# EAGLE board AK4493-v1.64_25 (EAGLE 9.6.2)
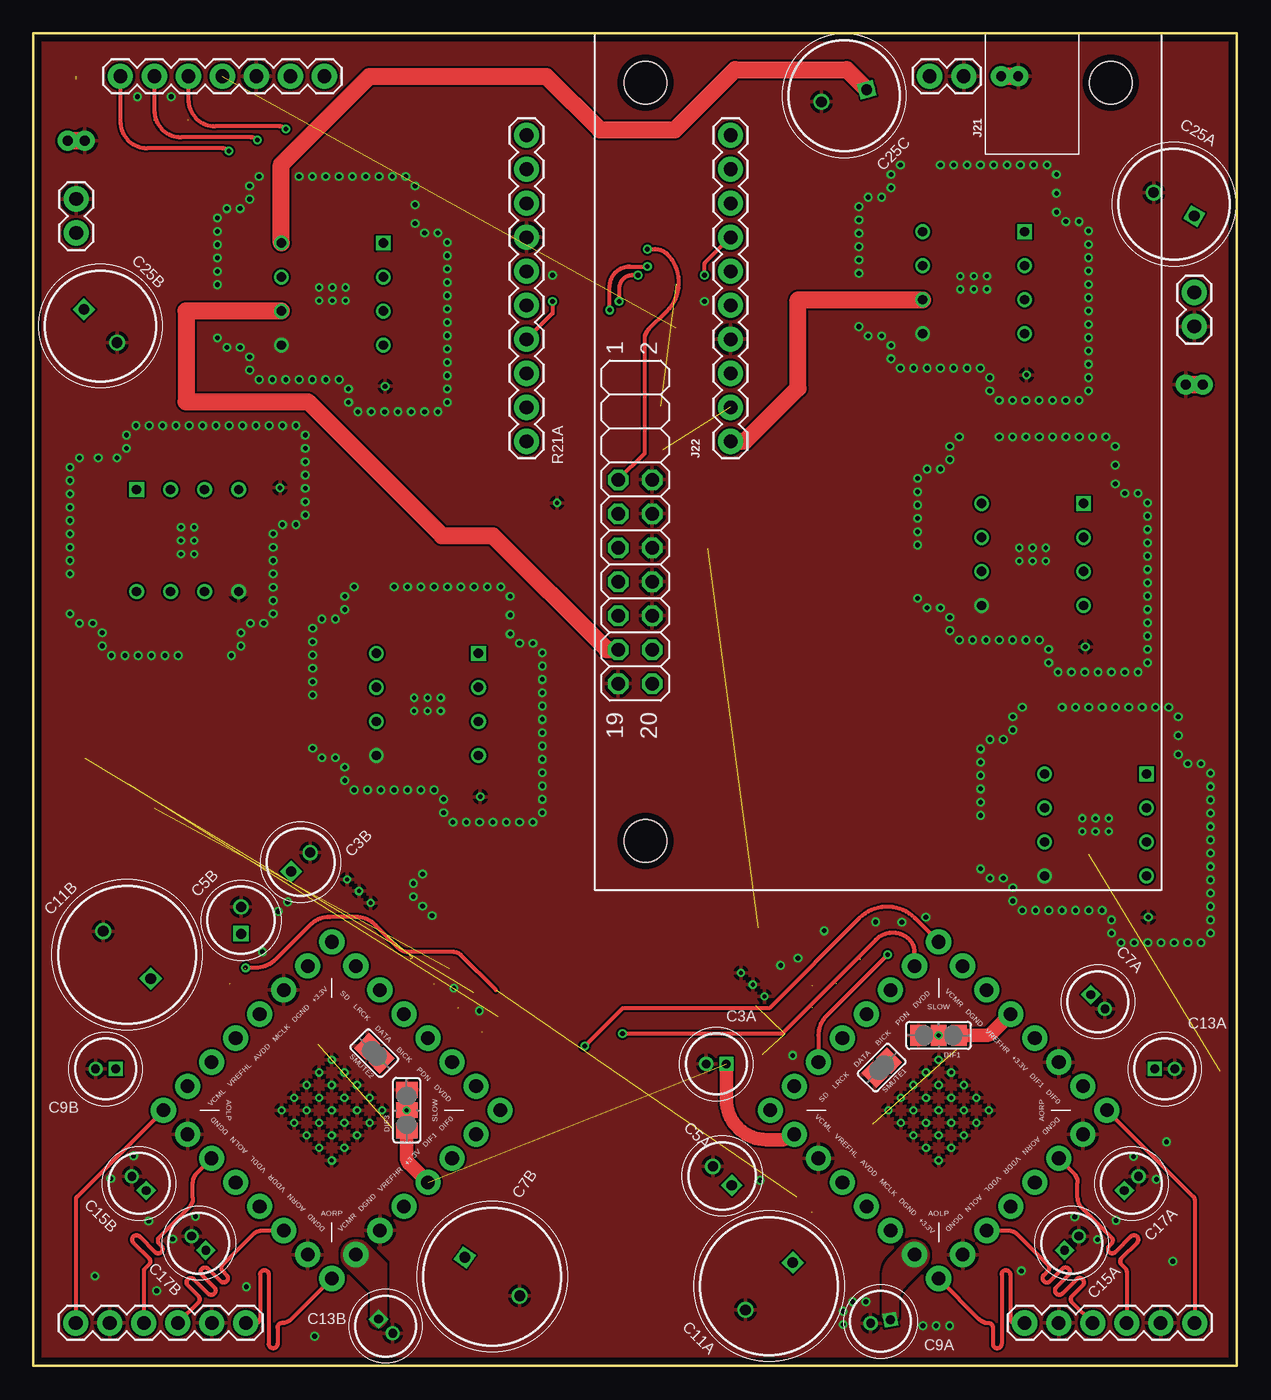
[diagram p2: board, top side]
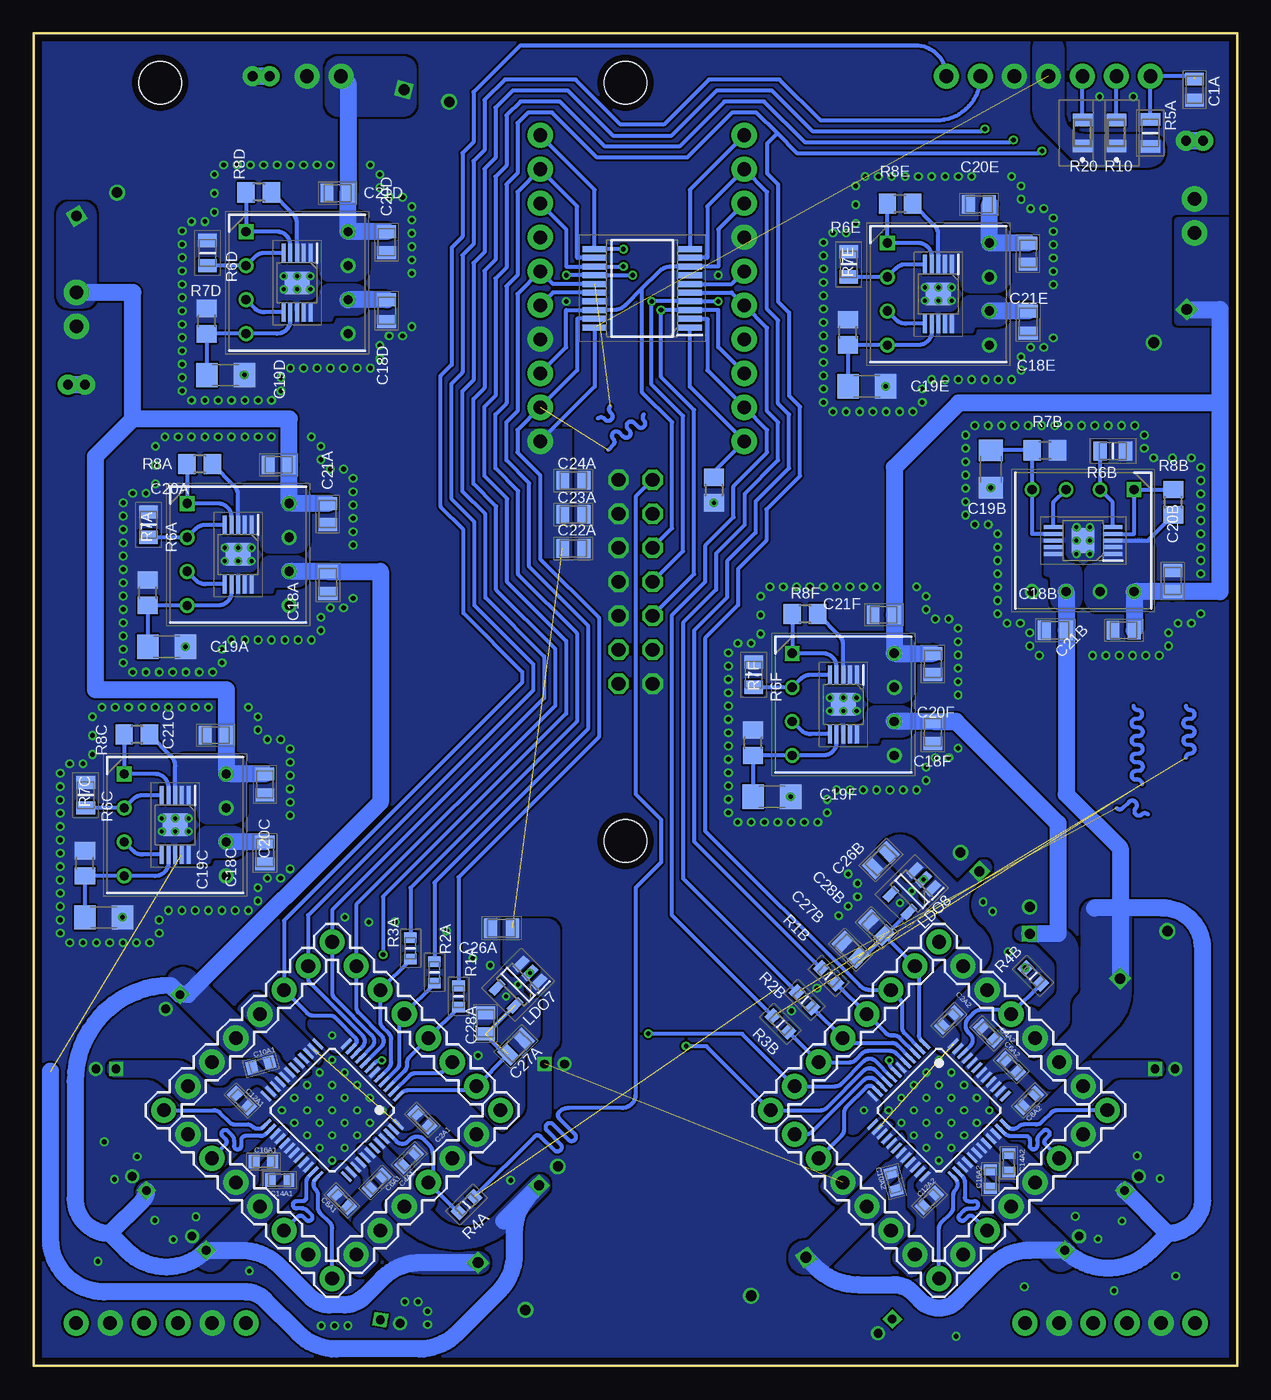
[diagram p3: board, bottom side, seen from below]

Size 89.89 x 99.5 mm. Coordinates in mm from the lower left corner, seen from the top.
Outline: 0,99.5 89.89,99.5 89.89,0 0,0 0,99.5
Copper layers (1*16): Top 0.035mm / dielectric 1.6mm / Bottom 0.035mm
Design rules "Elecrow_2-layer_PCB_eagle_rule": minimum track width 6mil, minimum drill 12mil, track to track 6mil, track to pad 6mil, pad to pad 6mil, via to via 8mil, smd to smd 0mil, copper to edge 20mil, drill to drill 10mil, minimum pad ring 6mil, minimum via ring 6mil, stop-mask expansion 0mil, vias tented up to drill 100mil, thermal gap 10mil
Net classes: 3 Power: width 1.27 mm, drill 1.27 mm, clearance 0.254 mm

## Footprints (pad centres in the part's own frame; a part is rotated, then mirrored left to right if it is on the bottom)
I2SOVERUSBV3 = drill 1.016 octagon: H3.7 33.322,1.745; H3.8 33.322,4.285; H3.9 35.862,1.745; H3.10 35.862,4.285; H3.11 38.403,1.745; H3.12 38.403,4.285; H3.13 40.943,1.745; H3.14 40.943,4.285; H3.15 43.483,1.745; H3.16 43.483,4.285; H3.17 46.023,1.745; H3.18 46.023,4.285; H3.19 48.562,1.745; H3.20 48.562,4.285 | hole 3.175: 3.688,3.775; 3.688,38.525; 60.312,3.775
CAPC2012X135N = smd 0.96 x 1.39: 1 -0.79,0; 2 0.79,0
CAPC1608X95N = smd 0.81 x 0.99: 1 -0.69,0; 2 0.69,0
CAPPRD150W45D450H600 = drill 0.65 pad 1.05 square: 1 0,0 | drill 0.65 pad 1.05: 2 1.5,0
CAPPRD200W55D500H800 = drill 0.75 pad 1.15 square: 1 0,0 | drill 0.75 pad 1.15: 2 2,0
CAPPRD500W60D1025H2150 = drill 0.8 pad 1.2 square: 1 0,0 | drill 0.8 pad 1.2: 2 5,0
CAPC2013X140N = smd 0.96 x 1.44: 1 -0.82,0; 2 0.82,0
C1206 = smd 1.6 x 1.8: 1 -1.4,0; 2 1.4,0 | drill 0.35: DGND 1.4,0
CAPPRD350W60D825H1300 = drill 0.8 pad 1.2 square: 1 0,0 | drill 0.8 pad 1.2: 2 3.5,0
SJ_2 = smd 1.168 x 1.6: 1 -1.524,0; 2 0,0; 3 1.524,0
SOP50P490X110-11N = smd 1.425 x 0.3: 1 -2.212,1; 2 -2.212,0.5; 3 -2.212,0; 4 -2.212,-0.5; 5 -2.212,-1; 6 2.212,-1; 7 2.212,-0.5; 8 2.212,0; 9 2.212,0.5; 10 2.212,1 | smd 1.68 x 1.88: 11 0,0 | drill 0.305 pad 0.61: P$1 -0.498,0; P$2 0.498,0; P$3 -0.498,0.995; P$4 0.498,0.995; P$5 -0.498,-0.995; P$6 0.498,-0.995
LQFP48_ = smd 0.25 x 1: 1 -2.75,-4.25; 2 -2.25,-4.25; 3 -1.75,-4.25; 4 -1.25,-4.25; 5 -0.75,-4.25; 6 -0.25,-4.25; 7 0.25,-4.25; 8 0.75,-4.25; 9 1.25,-4.25; 10 1.75,-4.25; 11 2.25,-4.25; 12 2.75,-4.25; 25 2.75,4.25; 26 2.25,4.25; 27 1.75,4.25; 28 1.25,4.25; 29 0.75,4.25; 30 0.25,4.25; 31 -0.25,4.25; 32 -0.75,4.25; 33 -1.25,4.25; 34 -1.75,4.25; 35 -2.25,4.25; 36 -2.75,4.25 | smd 1 x 0.25: 13 4.25,-2.75; 14 4.25,-2.25; 15 4.25,-1.75; 16 4.25,-1.25; 17 4.25,-0.75; 18 4.25,-0.25; 19 4.25,0.25; 20 4.25,0.75; 21 4.25,1.25; 22 4.25,1.75; 23 4.25,2.25; 24 4.25,2.75; 37 -4.25,2.75; 38 -4.25,2.25; 39 -4.25,1.75; 40 -4.25,1.25; 41 -4.25,0.75; 42 -4.25,0.25; 43 -4.25,-0.25; 44 -4.25,-0.75; 45 -4.25,-1.25; 46 -4.25,-1.75; 47 -4.25,-2.25; 48 -4.25,-2.75 | drill 0.305 pad 0.61: P$1 0,0; P$2 -1.327,0; P$3 -2.655,0; P$4 1.327,0; P$5 2.655,0; P$6 0,1.327; P$7 0,2.655; P$8 0,-1.327; P$9 0,-2.655; P$10 -1.327,-1.327; P$11 -2.655,-1.327; P$12 -2.655,-2.655; P$13 -1.327,-2.655; P$14 1.327,-2.655; P$15 2.655,-2.655; P$16 2.655,-1.327; P$17 1.327,-1.327; P$18 1.327,1.327; P$19 2.655,1.327; P$20 2.655,2.655; P$21 1.327,2.655; P$22 -1.327,2.655; P$23 -2.655,2.655; P$24 -2.655,1.327; P$25 -1.327,1.327
SOP65P780X200-20N = smd 1.8 x 0.45: 1 -3.55,2.925; 2 -3.55,2.275; 3 -3.55,1.625; 4 -3.55,0.975; 5 -3.55,0.325; 6 -3.55,-0.325; 7 -3.55,-0.975; 8 -3.55,-1.625; 9 -3.55,-2.275; 10 -3.55,-2.925; 11 3.55,-2.925; 12 3.55,-2.275; 13 3.55,-1.625; 14 3.55,-0.975; 15 3.55,-0.325; 16 3.55,0.325; 17 3.55,0.975; 18 3.55,1.625; 19 3.55,2.275; 20 3.55,2.925
1X02 = drill 1.016 pad 1.88: 1 0,0; 2 2.54,0
1X07 = drill 1.016 pad 1.88: 1 0,0; 2 2.54,0; 3 5.08,0; 4 7.62,0; 5 10.16,0; 6 12.7,0; 7 15.24,0
1X06 = drill 1.016 pad 1.88: 1 0,0; 2 2.54,0; 3 5.08,0; 4 7.62,0; 5 10.16,0; 6 12.7,0
DIPS762W51P254L1016H390Q8N = drill 0.7 pad 1.1 square: 1 0,0 | drill 0.7 pad 1.1: 2 0,-2.54; 3 0,-5.08; 4 0,-7.62; 5 7.62,-7.62; 6 7.62,-5.08; 7 7.62,-2.54; 8 7.62,0
1X10 = drill 1.016 pad 1.88: 1 0,0; 2 2.54,0; 3 5.08,0; 4 7.62,0; 5 10.16,0; 6 12.7,0; 7 15.24,0; 8 17.78,0; 9 20.32,0; 10 22.86,0
SOT95P280X145-5N = smd 1.2 x 0.6: 1 -1.25,0.95; 2 -1.25,0; 3 -1.25,-0.95; 4 1.25,-0.95; 5 1.25,0.95 | drill 0.305 pad 0.61: DGND -1.25,0; DGND2 0,0; DGND3 1.25,0
RESC1608X55N = smd 0.8 x 0.95: 1 -0.8,0; 2 0.8,0
RESC2012X50N = smd 0.95 x 1.45: 1 -1,0; 2 1,0
RESC2012X60N = smd 1 x 1.4: 1 -0.95,0; 2 0.95,0
R0805 = smd 1.3 x 1.5: 1 -0.95,0; 2 0.95,0
RCS0805_E3 = smd 0.95 x 1.45: 1 -0.975,0; 2 0.975,0
R0805-POL = smd 1.3 x 1.5: 1 -0.95,0; 2 0.95,0 | drill 0.305 pad 0.61: DGND 0.95,0
SHORT_ALL-50 = drill 0.737 pad 1.524: 1 -0.635,0; 2 0.635,0
SJ = smd 1.168 x 1.6: 1 -0.762,0; 2 0.762,0

## Placement (x,y rotation side)
BD1  I2SOVERUSBV3  [I2SOVERUSBV3]  41.93,99.5 270 top
C1A  0.1uF, X7R  [CAPC2012X135N]  3.19,95.31 270 bottom
C2A1  0.1u, Ceramic Capacitor X7R  [CAPC1608X95N]  60.87,18.35 315 bottom
C2A2  0.1u, Ceramic Capacitor X7R  [CAPC1608X95N]  21.55,25.82 45 bottom
C3A  80-A758BG106M1EAAE70  [CAPPRD150W45D450H600]  51.75,22.53 180 top
C3B  80-A758BG106M1EAAE70  [CAPPRD200W55D500H800]  19.25,36.9 45 top
C4A1  0.1u, Ceramic Capacitor X7R  [CAPC1608X95N]  61.86,15.42 45 bottom
C4A2  0.1u, Ceramic Capacitor X7R  [CAPC1608X95N]  18.62,24.83 135 bottom
C5A  80-A758BG106M1EAAE70  [CAPPRD200W55D500H800]  52.15,13.47 135 top
C5B  80-A758BG106M1EAAE70  [CAPPRD200W55D500H800]  15.5,32.26 90 top
C6A1  0.1u, Ceramic Capacitor X7R  [CAPC1608X95N]  64.3,13.68 225 bottom
C6A2  0.1u, Ceramic Capacitor X7R  [CAPC1608X95N]  16.88,22.39 315 bottom
C7A  RNU1A100MDSASQ  [CAPPRD150W45D450H600]  78.97,27.72 315 top
C7B  APSG160ELL222MJ20S  [CAPPRD500W60D1025H2150]  32.22,8.09 325 top
C8A1  0.1u, Ceramic Capacitor X7R  [CAPC1608X95N]  66.88,12.34 315 bottom
C8A2  0.1u, Ceramic Capacitor X7R  [CAPC1608X95N]  15.54,19.81 45 bottom
C9A  647-RNU1A100MDSASQ  [CAPPRD150W45D450H600]  64,3.44 190 top
C9B  647-RNU1A100MDSASQ  [CAPPRD150W45D450H600]  6.14,22.17 180 top
C10A1  0.1u, Ceramic Capacitor X7R  [CAPC1608X95N]  72.93,22.46 195 bottom
C10A2  0.1u, Ceramic Capacitor X7R  [CAPC1608X95N]  25.66,13.75 285 bottom
C11A  APSG160ELL222MJ20S  [CAPPRD500W60D1025H2150]  56.71,7.7 225 top
C11B  2200uF, 10V  [CAPPRD500W60D1025H2150]  8.75,28.92 135 top
C12A1  0.1u, Ceramic Capacitor X7R  [CAPC1608X95N]  74.34,19.8 315 bottom
C12A2  0.1u, Ceramic Capacitor X7R  [CAPC1608X95N]  23.01,12.34 45 bottom
C13A  647-RNU1A100MDSASQ  [CAPPRD150W45D450H600]  83.75,22.17 0 top
C13B  647-RNU1A100MDSASQ  [CAPPRD150W45D450H600]  25.77,3.49 315 top
C14A1  0.1u, Ceramic Capacitor X7R  [CAPC1608X95N]  71.53,13.86 180 bottom
C14A2  0.1u, Ceramic Capacitor X7R  [CAPC1608X95N]  17.06,15.15 270 bottom
C15A  647-RNU1A100MDSASQ  [CAPPRD150W45D450H600]  77.01,8.62 45 top
C15B  647-RNU1A100MDSASQ  [CAPPRD150W45D450H600]  8.41,13.08 135 top
C16A1  0.1u, Ceramic Capacitor X7R  [CAPC1608X95N]  72.74,15.24 0 bottom
C16A2  0.1u, Ceramic Capacitor X7R  [CAPC1608X95N]  18.45,13.95 90 bottom
C17A  647-RNU1A100MDSASQ  [CAPPRD150W45D450H600]  81.48,13.08 45 top
C17B  647-RNU1A100MDSASQ  [CAPPRD150W45D450H600]  12.88,8.62 135 top
C18A  4.7u  [CAPC2013X140N]  67.93,58.5 270 bottom
C18B  4.7u  [CAPC2013X140N]  13.6,54.93 180 bottom
C18C  4.7u  [CAPC2013X140N]  72.63,38.3 270 bottom
C18D  4.7u  [CAPC2013X140N]  63.53,78.8 270 bottom
C18E  4.7u  [CAPC2013X140N]  15.63,77.95 270 bottom
C18F  4.7u  [CAPC2013X140N]  22.73,47.3 270 bottom
C19A  22u  [C1206]  79.97,53.69 0 bottom
C19B  22u  [C1206]  18.41,66.97 270 bottom
C19C  22u  [C1206]  84.67,33.49 0 bottom
C19D  22u  [C1206]  75.57,73.99 0 bottom
C19E  22u  [C1206]  27.67,73.14 0 bottom
C19F  22u  [C1206]  34.77,42.49 0 bottom
C20A  10u  [CAPC2012X135N]  71.61,67.28 180 bottom
C20B  10u  [CAPC2012X135N]  4.82,58.61 90 bottom
C20C  10u  [CAPC2012X135N]  72.63,43.41 270 bottom
C20D  10u  [CAPC2012X135N]  63.53,83.91 270 bottom
C20E  10u  [CAPC2012X135N]  19.31,86.73 180 bottom
C20F  10u  [CAPC2012X135N]  22.73,52.41 270 bottom
C21A  0.1u  [CAPC2012X135N]  67.93,63.61 270 bottom
C21B  0.1u  [CAPC2012X135N]  8.49,54.93 180 bottom
C21C  0.1u  [CAPC2012X135N]  76.31,47.08 180 bottom
C21D  0.1u  [CAPC2012X135N]  67.21,87.58 180 bottom
C21E  0.1u  [CAPC2012X135N]  15.63,83.06 270 bottom
C21F  0.1u  [CAPC2012X135N]  26.41,56.08 180 bottom
C22A  0.1u, Ceramic Capacitor X7R  [CAPC2012X135N]  49.59,61.03 0 bottom
C23A  0.1u, Ceramic Capacitor X7R  [CAPC2012X135N]  49.59,63.57 0 bottom
C24A  0.1u, Ceramic Capacitor X7R  [CAPC2012X135N]  49.59,66.11 0 bottom
C25A  470u  [CAPPRD350W60D825H1300]  86.7,85.87 150 top
C25B  470u  [CAPPRD350W60D825H1300]  3.77,78.89 315 top
C25C  470u  [CAPPRD350W60D825H1300]  62.24,95.3 195 top
C26A  4.7u, Ceramic Capacitor X7R  [CAPC2013X140N]  54.96,32.68 180 bottom
C26B  4.7u, Ceramic Capacitor X7R  [CAPC2013X140N]  26.62,37.76 225 bottom
C27A  4.7u, Ceramic Capacitor X7R  [CAPC2013X140N]  53.87,23.84 45 bottom
C27B  4.7u, Ceramic Capacitor X7R  [CAPC2013X140N]  28.89,31.07 135 bottom
C28A  0.1u, Ceramic Capacitor X7R  [CAPC2012X135N]  56.14,25.57 90 bottom
C28B  0.1u, Ceramic Capacitor X7R  [CAPC2012X135N]  26.93,32.71 135 bottom
DIF1  [SJ_2]  67.61,24.67 0 top
DIF3  [SJ_2]  27.88,19.08 270 top
IC1  LT3042  [SOP50P490X110-11N]  74.63,60.59 270 bottom
IC2  AK4493  [LQFP48_]  67.61,19.08 135 bottom
IC3  AK4493  [LQFP48_]  22.28,19.08 225 bottom
IC4  LT3042  [SOP50P490X110-11N]  79.33,40.39 270 bottom
IC4A  SN74ABT273DBR  [SOP65P780X200-20N]  44.44,80.47 180 bottom
IC5  LT3042  [SOP50P490X110-11N]  11.51,61.63 180 bottom
IC6  LT3042  [SOP50P490X110-11N]  70.23,80.89 270 bottom
IC7  LT3042  [SOP50P490X110-11N]  29.43,49.39 270 bottom
IC8  LT3042  [SOP50P490X110-11N]  22.33,80.04 270 bottom
J1  [1X02]  3.19,84.6 90 top
J2  [1X02]  66.94,96.31 0 top
J3  [1X07]  6.49,96.31 0 top
J4  [1X06]  74.03,3.19 0 top
J5  [1X07]  80.18,19.08 45 bottom
J6  [1X07]  67.61,6.51 135 bottom
J7  [1X07]  55.03,19.08 225 bottom
J8  [1X07]  67.61,31.65 315 bottom
J9  [1X07]  22.28,6.51 135 bottom
J10  [1X07]  9.71,19.08 225 bottom
J11  [1X07]  22.28,31.65 315 bottom
J12  [1X07]  34.85,19.08 45 bottom
J13  [1X06]  3.16,3.19 0 top
J14  [1X02]  86.7,80.16 270 top
J15  XR2A-0811-N  [DIPS762W51P254L1016H390Q8N]  78.44,64.4 0 bottom
J16  XR2A-0811-N  [DIPS762W51P254L1016H390Q8N]  83.14,44.2 0 bottom
J17  XR2A-0811-N  [DIPS762W51P254L1016H390Q8N]  7.7,65.44 270 bottom
J18  XR2A-0811-N  [DIPS762W51P254L1016H390Q8N]  74.04,84.7 0 bottom
J19  XR2A-0811-N  [DIPS762W51P254L1016H390Q8N]  33.24,53.2 0 bottom
J20  XR2A-0811-N  [DIPS762W51P254L1016H390Q8N]  26.14,83.85 0 bottom
J21  [1X10]  36.82,91.9 270 top
J22  [1X10]  52.06,69.04 90 top
LDO7  LP5907-1.8V  [SOT95P280X145-5N]  53.72,28.46 225 bottom
LDO8  LP5907-1.8V  [SOT95P280X145-5N]  24.31,35.44 225 bottom
R1A  RT0603DRE075R1L  [RESC1608X55N]  58.17,27.57 270 bottom
R1B  RT0603DRE075R1L  [RESC1608X55N]  30.53,29.12 315 bottom
R2A  RT0603DRE075R1L  [RESC1608X55N]  59.96,29.37 270 bottom
R2B  RT0603DRE075R1L  [RESC1608X55N]  32.32,27.32 315 bottom
R3A  RT0603DRE075R1L  [RESC1608X55N]  61.76,31.16 270 bottom
R3B  RT0603DRE075R1L  [RESC1608X55N]  34.12,25.53 315 bottom
R4A  RT0603DRE075R1L  [RESC1608X55N]  57.57,12.04 225 bottom
R4B  RT0603DRE075R1L  [RESC1608X55N]  15.24,29.12 315 bottom
R5A  10K, Resistor 1%  [RESC2012X50N]  6.49,92.07 270 bottom
R6A  1k  [RESC2012X60N]  81.32,62.81 90 bottom
R6B  1k  [RESC2012X60N]  9.29,68.32 0 bottom
R6C  1k  [RESC2012X60N]  86.02,42.61 90 bottom
R6D  1k  [RESC2012X60N]  76.92,83.11 90 bottom
R6E  1k  [RESC2012X60N]  29.02,82.26 90 bottom
R6F  1k  [RESC2012X60N]  36.12,51.61 90 bottom
R7A  33k  [R0805]  81.37,57.73 90 bottom
R7B  33k  [R0805]  14.37,68.37 0 bottom
R7C  33k  [R0805]  86.07,37.53 90 bottom
R7D  33k  [R0805]  76.97,78.03 90 bottom
R7E  33k  [R0805]  29.07,77.18 90 bottom
R7F  33k  [R0805]  36.17,46.53 90 bottom
R8A  200k  [R0805]  77.49,67.33 180 bottom
R8B  200k  [R0805]  4.77,64.49 90 bottom
R8C  200k  [R0805]  82.19,47.13 180 bottom
R8D  200k  [R0805]  73.09,87.63 180 bottom
R8E  200k  [R0805]  25.19,86.78 180 bottom
R8F  200k  [R0805]  32.29,56.13 180 bottom
R10  2.2k, 1%  [RCS0805_E3]  9.03,92.07 90 bottom
R20  2.2k, 1%  [RCS0805_E3]  11.57,92.07 90 bottom
R21A  Not Pop.  [R0805-POL]  39.1,65.39 270 bottom
SH1  SHORTA5  [SHORT_ALL-50]  3.19,91.49 180 top
SH2  SHORTA5  [SHORT_ALL-50]  72.91,96.31 180 top
SH3  SHORTA5  [SHORT_ALL-50]  86.7,73.27 0 top
SMUTE1  [SJ]  63.35,22.26 225 top
SMUTE2  [SJ]  25.46,23.33 135 top

## Tracks (layer width: path | path; a pad name or v marks a point on that pad's centre or on a via)
+3V3  (5 unrouted)
  Top 1.016: 71.58,24.85 arc-45 71.15,24.67 DIF1.3 | 28.05,15.1 arc-45 27.88,15.53 DIF3.3 | J7.2 arc-45 55.86,16.88 54.75,16.88 arc-90 51.75,19.88 C3A.1
  Top 1.06: J5.5 71.58,24.85 | J9.5 28.05,15.1
  Top 1.272: J22.1 53.14,69.04 57.1,73 57.1,79.62 J18.6
  Bottom 0.305: IC4A.20 47.99,73.11 J22.1
  Bottom 1.272: C18D.1 J18.6
  pour Bottom (no thermals): 5.39,90.74 arc90 6.64,89.49 10.87,89.49 arc45 12.28,90.08 14.72,92.52 arc45 15.3,93.93 15.3,98.36 arc90 14.17,99.5 arc90 12.92,98.25 12.92,93.49 arc-90 11.42,91.99 6.64,91.99 arc90
  pour Bottom (no thermals): 21.82,26.84 18.97,29.68 arc-90 18.97,30.54 19.8,31.37 arc-90 20.66,31.37 23.6,28.43 arc-45 23.82,27.88 23.82,25.22 arc-45 23.64,24.79 22.36,23.51 arc-90 21.5,23.51 20.99,24.01 arc-90 20.99,25.15 21.82,25.97 arc90
  pour Bottom (no thermals): 56.14,15.77 55.32,16.59 arc-90 55.32,17.46 58.25,20.39 arc-45 58.8,20.62 61.46,20.62 arc-45 61.89,20.44 63.18,19.16 arc-90 63.18,18.29 62.67,17.78 arc-90 61.54,17.78 60.71,18.61 arc90 59.85,18.61 57,15.77 arc-90
  pour Bottom (rank 2, no thermals): 29.29,12.18 24.99,16.48 arc-90 24.99,17.34 25.79,18.14 arc-90 26.65,18.14 30.95,13.84 arc-90 30.95,12.97 30.15,12.18 arc-90
  pour Bottom (rank 2, no thermals): 74.51,26.09 70.21,21.79 arc-90 69.35,21.79 68.55,22.58 arc-90 68.55,23.45 72.85,27.75 arc-90 73.71,27.75 74.51,26.95 arc-90
  pour Bottom (no thermals): 23.59,34.92 23.48,34.82 arc-90 23.02,34.82 21.58,36.27 arc-90 21.58,36.73 24.05,39.2 arc-90 26.31,39.2 26.74,38.77 arc-90 26.74,38.31 24.71,36.28 arc-90 24.25,36.28 23.48,37.05 arc90 23.02,37.05 22.7,36.73 arc90 22.7,36.27 23.59,35.38 arc-90
  pour Bottom (no thermals): 20.91,36.06 19.28,37.69 arc45 18.96,37.83 arc90 18.33,37.2 arc45 18.47,36.88 19.48,35.87 arc-90 19.48,33.04 18.97,32.53 arc90 18.97,29.68 20.66,31.37 arc-90 20.66,32 23.48,34.82 21.58,36.73
  pour Bottom (no thermals): 54.89,30.16 54.89,33.15 arc90 54.64,33.4 51.57,33.4 arc90 50.57,32.4 50.57,24.44 arc45 50.86,23.73 50.92,23.68 arc-45 51.22,22.97 51.22,21.66 arc90 52.21,20.66 arc90 53.02,21.46 53.02,22.88 arc45 52.72,23.58 52.14,24.16 arc-45 51.85,24.87 51.85,27.36 arc-90 52.1,27.61 52.57,27.61 arc45 52.75,27.69 53.06,27.99 arc90 53.06,28.35 52.06,29.34 arc-90 52.06,29.7 52.49,30.12 arc-90 52.84,30.12 53.72,29.24 arc90 54.07,29.24 54.81,29.98 arc45
  pour Bottom (no thermals): 51.22,21.66 51.22,19.05 arc47 51.84,17.6 54.03,15.54 arc88 56.81,15.58 57,15.77 55.32,17.46 arc-90 54.45,17.46 53.31,18.6 arc-45 53.02,19.31 53.02,21.66
  pour Bottom (no thermals): 69.9,79.39 69.9,77.96 67.79,77.96 arc-90 67.56,78.19 arc90 67.33,78.42 65.9,78.42 arc-90 64.9,79.42 64.9,79.81 arc-90 65.9,80.81 67.84,80.81 arc-90 68.56,80.1 arc90 69.27,79.39
  pour Bottom (no thermals): 52.06,60.33 52.06,66.6 53.76,68.26 53.76,69.97 49.67,69.97 49.67,60.58 arc90 49.92,60.33
+5V/1
  Bottom 1.272: 84.22,9.88 arc90 86.8,12.46 86.8,21.26 arc90 79.66,28.4 C7A.1 78.38,27.72 64,42.1 64,59.32 C18A.1 J15.6 | 81.48,13.04 arc45 81.77,12.33 84.22,9.88 | 84.22,9.88 82.96,8.62 arc-90 C15A.1 | C15A.1 | C15A.1 74.38,8.62 arc45 71.55,7.45 69.24,5.14 arc-45 67.82,4.55 66.65,4.55 arc-45 65.23,5.14 63.84,6.53 arc45 61.01,7.7 C11A.1
  pour Bottom (no thermals): 63.77,11.54 62.5,10.27 arc90 62.5,9.41 63.33,8.58 arc90 64.19,8.58 65.87,10.26 arc90 65.87,11.12 64.18,12.81 arc-90 64.18,13.67 64.54,14.03 arc45 64.72,14.46 64.72,14.63 arc-45 64.9,15.06 65.6,15.77 arc180 65.01,16.37 62.84,14.2 arc90 62.84,13.34 63.77,12.4 arc-90
  pour Bottom (no thermals): 70.32,21.68 71.41,22.77 arc45 71.48,22.95 arc-45 71.54,23.09 74.52,26.07 arc-90 75.39,26.07 76.3,25.15 arc-90 76.3,24.29 75.22,23.21 arc-45 74.79,23.03 73.65,23.03 arc45 73.22,22.85 72.53,22.16 arc-45 72.1,21.98 72.07,21.98 arc45 71.64,21.81 70.91,21.08 arc-180
  pour Bottom (no thermals): 68.9,15.06 arc-180 69.5,15.66 71.75,13.41 arc45 72.18,13.23 73.09,13.23 arc-45 73.52,13.05 74.51,12.07 arc-90 74.51,11.21 73.68,10.38 arc-90 72.82,10.38 70.3,12.9 arc-45 70.12,13.33 70.12,13.59 arc45 69.95,14.02
  pour Bottom (no thermals): 71.62,17.78 arc180 71.02,17.18 72.91,15.29 arc-45 73.09,14.86 73.09,13.95 arc45 73.27,13.52 73.79,13 arc90 76.3,13 arc90 76.3,13.86 74.56,15.61 arc45 74.13,15.79 73.87,15.79 arc-45 73.44,15.97
  pour Bottom (no thermals): 76.3,24.29 79.64,27.62 arc90 79.64,29.41 arc90 77.86,29.41 74.52,26.07
  pour Bottom (rank 2, no thermals): 62.5,10.27 arc-45 58,8.54 56.66,8.54 arc90 55.81,7.69 arc90 56.66,6.84 60.93,6.84 arc45 63.52,7.91 64.19,8.58
  pour Bottom (no thermals): 72.82,10.38 75.84,7.36 arc90 77.53,7.36 77.74,7.57 arc90 77.74,8.84 74.51,12.07
  pour Bottom (no thermals): 74.12,14.36 arc90 74.12,12.66 74.47,12.32 arc45 75.18,12.03 81.36,12.03 arc90 82.27,12.93 arc90 81.36,13.83 76.76,13.83 arc-45 76.05,14.12 75.81,14.35 arc90
  pour Bottom (no thermals): 74.3,59.09 74.3,57.66 72.19,57.66 arc-90 71.96,57.89 arc90 71.73,58.12 70.3,58.12 arc-90 69.3,59.12 69.3,59.51 arc-90 70.3,60.51 72.24,60.51 arc-90 72.96,59.8 arc90 73.67,59.09
+5V/2
  Bottom 1.272: 5.17,9.88 arc-90 2.59,12.46 2.59,31.19 arc-90 5.59,34.19 10.68,34.19 | C7B.1 31.47,7.34 arc-45 28.35,6.05 25.67,6.05 arc45 24.25,5.46 23.67,4.89 arc-45 22.26,4.3 arc-45 20.94,4.85 18.34,7.45 arc45 15.51,8.62 C17B.1 arc-90 6.43,8.62 5.17,9.88 | C15B.1 5.21,9.88 5.17,9.88 | J17.6 C18B.1 12.78,42.68 8.75,38.65 C11B.1
  pour Bottom (no thermals): 24.88,16.37 25.98,15.28 arc45 26.15,15.2 arc-45 26.29,15.14 29.28,12.16 arc-90 29.28,11.3 28.36,10.38 arc-90 27.5,10.38 26.41,11.46 arc-45 26.24,11.89 26.24,13.04 arc45 26.06,13.47 25.37,14.16 arc-45 25.19,14.59 25.19,14.61 arc45 25.01,15.04 24.28,15.77 arc-180
  pour Bottom (no thermals): 14.75,22.91 13.48,24.18 arc90 12.61,24.18 11.79,23.36 arc90 11.79,22.5 13.47,20.82 arc90 14.33,20.82 16.01,22.5 arc-90 16.88,22.5 17.23,22.14 arc45 17.67,21.97 17.84,21.97 arc-45 18.27,21.79 18.97,21.08 arc180 19.57,21.68 17.4,23.85 arc90 16.54,23.85 15.61,22.91 arc-90
  pour Bottom (no thermals): 20.99,15.06 arc180 20.39,15.66 18.5,13.77 arc-45 18.06,13.59 17.16,13.59 arc45 16.72,13.41 15.38,12.07 arc90 15.38,11.21 16.21,10.38 arc90 17.07,10.38 18.82,12.13 arc45 18.99,12.56 18.99,12.82 arc-45 19.17,13.25
  pour Bottom (no thermals): 18.27,17.78 arc-180 18.87,17.18 16.61,14.93 arc45 16.43,14.5 16.43,13.59 arc-45 16.26,13.16 15.27,12.18 arc-90 14.41,12.18 13.58,13 arc-90 13.58,13.86 16.1,16.38 arc-45 16.53,16.56 16.79,16.56 arc45 17.22,16.74
  pour Bottom (no thermals): 11.68,28.29 11.68,33.83 arc90 10.68,34.83 8.88,34.83 arc90 7.88,33.83 7.88,28.06 arc45 9.06,25.23 11.79,22.5 13.48,24.18 12.62,25.04 arc-45 12.33,25.74 12.33,26.71 arc45 11.96,27.61 arc-45
  pour Bottom (no thermals): 27.5,10.38 30.47,7.41 arc45 31.88,6.82 32.27,6.82 arc90 33.54,8.09 arc90 32.27,9.37 arc-45 31.92,9.51 29.27,12.16
  pour Bottom (no thermals): 15.76,14.36 arc-90 14.07,14.35 arc-90
  pour Bottom (no thermals): 15.76,14.36 arc-90 15.77,12.66 15.42,12.32 arc-45 14.71,12.03 8.52,12.03 arc-90 7.62,12.93 arc-90 8.52,13.83 13.13,13.83 arc45 13.84,14.12 14.07,14.35 arc-90
  pour Bottom (no thermals): 17.07,10.38 14.05,7.36 arc-90 12.36,7.36 12.15,7.57 arc-90 12.15,8.84 15.38,12.07
  pour Bottom (no thermals): 13.01,61.3 14.44,61.3 14.44,59.19 arc-90 14.21,58.96 arc90 13.98,58.73 13.98,57.3 arc-90 12.98,56.3 12.59,56.3 arc-90 11.59,57.3 11.59,59.24 arc-90 12.3,59.96 arc90 13.01,60.67
+5V/3
  Top 1.272: J20.6 11.4,78.77 11.4,72 20.5,72 30.5,62 34.3,62 42.82,53.48 BD1.H3.17
  Bottom 1.272: C18E.1 J20.6
  pour Bottom (no thermals): 22,78.54 22,77.11 19.89,77.11 arc-90 19.66,77.34 arc90 19.43,77.57 18,77.57 arc-90 17,78.57 17,78.96 arc-90 18,79.96 19.94,79.96 arc-90 20.66,79.25 arc90 21.37,78.54
+5V/4
  Bottom 1.272: J19.6 C18F.1 21.02,48.12 13.4,40.5 13.4,32.26 C5B.1
  pour Bottom (no thermals): 13.58,25.15 14.98,26.55 arc-90 16.4,26.55 18.56,24.4 arc-45 18.65,24.18 18.65,24.14 arc45 18.74,23.93 20.28,22.39 arc-180 20.03,22.14 19.58,22.6 arc45 18.87,22.89 arc-45 18.37,23.1 17.4,24.06 arc90 16.54,24.06 15.61,23.13 14.75,23.13 13.58,24.29 arc-90
  pour Bottom (rank 2, no thermals): 16.66,32.27 arc90 16.08,32.84 13.83,32.84 arc90 11.83,30.84 11.83,24.09 14.2,21.72 16.87,24.39 13.76,27.49 arc-45 13.47,28.2 13.47,29.78 arc-45 13.76,30.49 14.67,31.4 arc-45 15.37,31.69 16.08,31.69 arc90
  pour Bottom (no thermals): 29.1,47.89 29.1,46.46 26.99,46.46 arc-90 26.76,46.69 arc90 26.53,46.92 25.1,46.92 arc-90 24.1,47.92 24.1,48.31 arc-90 25.1,49.31 27.04,49.31 arc-90 27.76,48.6 arc90 28.47,47.89
+5V/5  (1 unrouted)
  Bottom 1.272: 88.64,21.98 88.64,9.52 arc-90 84.64,5.52 74.05,5.52 arc45 72.63,4.93 70.12,2.42 arc-45 67.29,1.25 61.11,1.25 arc-45 58.28,2.42 55.17,5.53 arc-45 54,8.36 54,9.96 arc45 52.83,12.79 C5A.1 54.8,10.82 | C18C.1 J16.6
  pour Bottom (no thermals): 61.53,10.38 60.13,11.78 arc-90 60.13,13.19 62.29,15.35 arc-45 62.5,15.44 62.54,15.44 arc45 62.76,15.53 64.3,17.08 arc-180 64.54,16.83 64.09,16.37 arc45 63.79,15.67 arc-45 63.59,15.17 62.62,14.2 arc90 62.62,13.34 63.55,12.4 arc-90 63.55,11.54 62.39,10.38 arc-90
  pour Bottom (no thermals): 51.55,12.93 54.1,10.38 arc90 62.39,10.38 60.7,12.07 59.78,11.17 arc-89 55.56,11.19 52.69,14.06 arc90 51.55,14.06 arc90
  pour Bottom (no thermals): 79,38.89 79,37.46 76.89,37.46 arc-90 76.66,37.69 arc90 76.43,37.92 75,37.92 arc-90 74,38.92 74,39.31 arc-90 75,40.31 76.94,40.31 arc-90 77.66,39.6 arc90 78.37,38.89
BCLK
  Bottom 0.305: 44.44,80.47 43.19,81.72 arc45 42.29,82.09 IC4A.8 38.77,82.09 38.77,84.88 J21.3 | 44.44,80.47 45.7,79.22 arc45 46.59,78.84 IC4A.18 50.12,78.84 50.12,76.06 J22.3 | 44.44,80.47 44.44,72.69 42.21,70.46 42.21,62.56 BD1.H3.11
DATA  (via drill 0.35)
  Top 0.305: v45.15,81.44 44.74,81.44 arc90 43.74,80.44 v43.74,79.5 | v38.77,79.5 38.77,78.6 J21.7 | v50.12,81.44 50.12,82.34 J22.7
  Bottom 0.305: v45.15,81.44 IC4A.14 v50.12,81.44 | v38.77,79.5 IC4A.4 v43.74,79.5 43.74,73.27 41.39,70.92 41.39,60.84 BD1.H3.13
DGND  (via drill 0.35)
  other vias: 73.15,35.7 72.44,36.41 82.23,31.6 81.23,31.6 80.53,32.3 80.53,33.3 76.84,34 77.83,34 78.83,34 79.82,34 29.07,36.72 28.36,36.02 28.36,35.02 29.07,34.32 29.77,33.61 87.91,32.3 87.2,31.6 86.21,31.6 85.21,31.6 84.22,31.6 83.22,31.6 68.42,2.98 67.42,2.98 66.43,2.98 60.48,3.07 60.48,4.07 61.18,4.77 62.18,4.77 77.77,11.12 79.47,9.42 5.78,13.97 7.48,15.67 10.4,9.46 12.1,11.16 82.17,15.62 83.87,13.92 18.98,34.63 18.27,33.93 17.1,30.9 33.3,26.5 31.4,28.2 54.27,13.85 57.1,30.44 59.06,32.48 62.9,33.15 64.86,33.13 66.66,33.5 10.28,94.77 7.76,94.77 85.1,7.8 84.63,16.72 73.78,7.08 80.85,10.86 21,2.2 15.9,5.9 9.2,5.6 4.6,6.7 8.6,10.8 55.8,29.9 56.71,23.17 50.12,79.5 38.77,81.44 71.14,54.2 70.15,54.2 69.15,54.2 68.45,54.91 68.45,55.9 67.74,56.61 77.53,51.8 76.53,51.8 75.83,52.5 75.83,53.5 72.14,54.2 73.13,54.2 74.13,54.2 75.12,54.2 83.21,52.5 82.5,51.8 81.51,51.8 80.51,51.8 79.52,51.8 78.52,51.8 66.04,64.28 66.04,57.31 66.75,56.61 66.04,61.29 66.04,62.29 66.04,63.28 67.74,66.97 68.45,67.68 66.04,65.27 66.04,66.27 66.75,66.97 69.15,69.38 68.45,68.67 80.8,65.86 81.51,65.15 72.14,69.38 73.13,69.38 77.11,69.38 76.12,69.38 75.12,69.38 74.13,69.38 78.11,69.38 79.11,69.38 80.1,69.38 80.8,68.67 80.8,67.26 83.21,63.45 83.21,64.45 82.5,65.15 83.21,62.46 83.21,61.46 83.21,60.47 83.21,59.47 83.21,58.48 83.21,57.48 83.21,56.49 83.21,55.49 83.21,54.5 83.21,53.5 66.74,74.5 65.75,74.5 64.75,74.5 64.05,75.21 64.05,76.2 63.34,76.91 73.13,72.1 72.13,72.1 71.43,72.8 71.43,73.8 67.74,74.5 68.73,74.5 69.73,74.5 70.72,74.5 78.81,72.8 78.1,72.1 77.11,72.1 76.11,72.1 75.12,72.1 74.12,72.1 78.81,77.78 78.81,76.79 78.81,75.79 78.81,74.8 78.81,73.8 78.81,82.76 78.81,81.76 78.81,80.77 78.81,79.77 78.81,78.78 78.81,83.75 78.81,84.75 78.1,85.45 76.4,86.16 77.11,85.45 67.74,89.68 68.73,89.68 72.71,89.68 71.72,89.68 70.72,89.68 69.73,89.68 73.71,89.68 74.71,89.68 75.7,89.68 76.4,88.97 76.4,87.56 64.75,89.68 64.05,88.97 63.34,87.27 64.05,87.98 61.64,85.57 61.64,86.57 62.35,87.27 61.64,84.58 61.64,77.61 62.35,76.91 61.64,81.59 61.64,82.59 61.64,83.58 6.24,67.8 6.95,68.51 2.72,59.14 2.72,60.13 2.72,64.11 2.72,63.12 2.72,62.12 2.72,61.13 2.72,65.11 2.72,66.11 2.72,67.1 3.43,67.8 4.84,67.8 8.65,70.21 7.65,70.21 6.95,69.5 9.64,70.21 10.64,70.21 11.63,70.21 12.63,70.21 13.62,70.21 14.62,70.21 15.61,70.21 16.61,70.21 17.6,70.21 16.2,55.45 15.49,54.74 20.3,64.53 20.3,63.53 19.6,62.83 18.6,62.83 17.9,59.14 17.9,60.13 17.9,61.13 17.9,62.12 19.6,70.21 20.3,69.5 20.3,68.51 20.3,67.51 20.3,66.52 20.3,65.52 18.6,70.21 17.9,58.14 17.9,57.15 17.9,56.15 17.19,55.45 7.82,53.04 14.79,53.04 15.49,53.75 10.81,53.04 9.81,53.04 8.82,53.04 6.83,53.04 5.83,53.04 5.13,53.75 5.13,54.74 4.42,55.45 2.72,56.15 3.43,55.45 22.54,55.77 23.25,56.48 23.95,58.18 23.25,57.47 35.6,54.66 36.31,53.95 26.94,58.18 27.93,58.18 31.91,58.18 30.92,58.18 29.92,58.18 28.93,58.18 32.91,58.18 33.91,58.18 34.9,58.18 35.6,57.47 35.6,56.06 38.01,51.26 38.01,50.26 38.01,49.27 38.01,48.27 38.01,47.28 38.01,52.25 38.01,53.25 37.3,53.95 38.01,46.28 38.01,45.29 38.01,44.29 38.01,43.3 23.25,44.7 22.54,45.41 32.33,40.6 31.33,40.6 30.63,41.3 30.63,42.3 26.94,43 27.93,43 28.93,43 29.92,43 38.01,41.3 37.3,40.6 36.31,40.6 35.31,40.6 34.32,40.6 33.32,40.6 38.01,42.3 25.94,43 24.95,43 23.95,43 23.25,43.71 20.84,53.08 20.84,46.11 21.55,45.41 20.84,50.09 20.84,51.09 20.84,52.08 20.84,54.07 20.84,55.07 21.55,55.77 25.81,88.83 26.81,88.83 27.8,88.83 28.5,88.12 28.5,86.71 28.5,85.31 29.21,84.6 19.84,88.83 20.83,88.83 24.81,88.83 23.82,88.83 22.82,88.83 21.83,88.83 30.91,82.9 30.91,83.9 30.2,84.6 30.91,81.91 30.91,80.91 30.91,79.92 30.91,78.92 30.91,77.93 30.91,76.93 30.91,75.94 30.91,74.94 30.91,73.95 16.15,75.35 15.44,76.06 25.23,71.25 24.23,71.25 23.53,71.95 23.53,72.95 19.84,73.65 20.83,73.65 21.83,73.65 22.82,73.65 30.91,71.95 30.2,71.25 29.21,71.25 28.21,71.25 27.22,71.25 26.22,71.25 30.91,72.95 18.84,73.65 17.85,73.65 16.85,73.65 16.15,74.36 13.74,83.73 13.74,76.76 14.45,76.06 13.74,80.74 13.74,81.74 13.74,82.73 13.74,84.72 13.74,85.72 14.45,86.42 15.44,86.42 16.15,87.13 16.85,88.83 16.15,88.12 72.44,46.77 73.15,47.48 73.85,49.18 73.15,48.47 85.5,45.66 86.21,44.95 76.84,49.18 77.83,49.18 81.81,49.18 80.82,49.18 79.82,49.18 78.83,49.18 82.81,49.18 83.81,49.18 84.8,49.18 85.5,48.47 85.5,47.06 87.91,43.25 87.91,44.25 87.2,44.95 87.91,42.26 87.91,41.26 87.91,40.27 87.91,39.27 87.91,38.28 87.91,37.28 87.91,36.29 87.91,35.29 87.91,34.3 87.91,33.3 75.84,34 74.85,34 73.85,34 73.15,34.71 70.74,44.08 70.74,37.11 71.45,36.41 70.74,41.09 70.74,42.09 70.74,43.08 70.74,45.07 70.74,46.07 71.45,46.77
  pour Top (rank 6): 0,0 0,99.5 89.89,99.5 89.89,0
  pour Bottom (rank 6, no thermals): 0,0 0,99.5 89.89,99.5 89.89,0
  pour Bottom (rank 6, no thermals): 53.26,18.65 67.18,4.73 arc90 68.04,4.73 81.95,18.65 arc90 81.95,19.51 68.04,33.42 arc90 67.18,33.42 53.26,19.51 arc90
  pour Top (rank 2): 52.11,19.08 67.61,3.59 83.1,19.08 67.61,34.57
  pour Bottom (no thermals): 68.62,22.1 69.96,23.45 70.21,23.2 68.86,21.86
  pour Bottom (rank 6, no thermals): 21.85,33.42 7.94,19.51 arc90 7.94,18.65 21.85,4.73 arc90 22.71,4.73 36.63,18.65 arc90 36.63,19.51 22.71,33.42 arc90
  pour Top (rank 2): 22.28,34.57 6.79,19.08 22.28,3.59 37.77,19.08
  pour Bottom (no thermals): 25.31,18.07 26.65,16.72 26.41,16.48 25.06,17.82
  pour Bottom (rank 6, no thermals): 84.66,45.72 84.66,35.06 74,35.06 74,45.72
  pour Top (no thermals): 84.66,45.72 74,45.72 74,35.06 84.66,35.06
  pour Bottom (rank 6, no thermals): 79.96,65.92 79.96,55.26 69.3,55.26 69.3,65.92
  pour Top (no thermals): 79.96,65.92 69.3,65.92 69.3,55.26 79.96,55.26
  pour Bottom (rank 6, no thermals): 6.18,66.96 16.84,66.96 16.84,56.3 6.18,56.3
  pour Top (no thermals): 6.78,68.16 6.78,57.5 17.44,57.5 17.44,68.16
  pour Bottom (rank 6, no thermals): 75.56,86.22 75.56,75.56 64.9,75.56 64.9,86.22
  pour Top (no thermals): 75.56,86.22 64.9,86.22 64.9,75.56 75.56,75.56
  pour Bottom (rank 6, no thermals): 34.76,54.72 34.76,44.06 24.1,44.06 24.1,54.72
  pour Top (no thermals): 34.76,54.72 24.1,54.72 24.1,44.06 34.76,44.06
  pour Bottom (rank 6, no thermals): 27.66,85.37 27.66,74.71 17,74.71 17,85.37
  pour Top (no thermals): 27.66,85.37 17,85.37 17,74.71 27.66,74.71
DIF0
  Bottom 0.305: IC2.10 65.35,23.81 arc-90 65.35,24.67 69.22,28.55 arc45 69.4,28.98 J5.7 69.4,33.64 52.6,50.45 52.6,52.4 56.98,56.78 56.98,63.02 58.68,64.72 58.68,73.36 57.86,74.18 57.86,82.94 57.04,83.76 57.04,89.98 56.22,90.8 56.22,94.54 54.7,96.06 | J3.6 arc90 22.51,92.99 31.11,92.99 34.19,96.06 39.46,96.06 42.82,92.7 46.06,92.7 49.42,96.06 54.7,96.06 | 54.7,96.06
DIF1
  Bottom 0.305: IC2.11 65.88,23.99 arc-90 65.88,24.5 67.36,25.98 arc-45 67.79,26.16 69.04,26.16 arc45 69.47,26.34 J5.6 71.2,33.24 53.42,51.03 53.42,51.82 57.8,56.2 57.8,62.44 59.5,64.14 59.5,73.94 58.68,74.76 58.68,83.52 57.86,84.34 57.86,90.56 57.04,91.38 57.04,95.12 53.56,98.6 24.02,98.6 arc90 J3.7
LRCK  (via drill 0.35)
  Top 0.305: v43.04,78.84 43.04,80.59 arc-90 44.54,82.09 v45.85,82.09
  Bottom 0.305: v45.85,82.09 IC4A.13 50.12,82.09 50.12,84.88 J22.8 | J21.8 38.77,76.06 38.77,78.84 IC4A.3 v43.04,78.84 43.04,73.85 40.57,71.39 40.57,59.12 BD1.H3.15
MCLK  (via drill 0.35)  (3 unrouted)
  Top 0.305: 34.55,28.05 31.9,30.7 arc45 31.44,30.89 28.04,30.89 arc-45 27.24,31.22 25.57,32.89 arc45 24.05,33.52 22.15,33.52 arc45 20.63,32.89 18.09,30.35 arc-45 16.57,29.72 v15.84,29.72 | v45.85,83.39 46.43,83.39 arc-45 47.33,83.02 arc-90 47.33,78.78 45.95,77.4 arc45 45.66,76.69 45.66,68.16 BD1.H3.7
  Bottom 0.305: 56.97,12.64 52.49,17.11 arc90 52.03,17.11 51.01,16.09 arc-90 50.55,16.09 arc-90 50.55,16.55 51.57,17.57 arc90 51.57,18.03 arc90 51.11,18.03 49.95,16.87 arc-90 49.49,16.87 arc-90 49.49,17.32 50.65,18.49 arc90 50.65,18.95 50.65,18.95 arc45 49.94,19.25 45.94,19.25 arc-90 44.94,20.25 44.94,35.69 43.03,37.6 43.03,40.79 44.94,42.7 44.94,64.91 BD1.H3.7 | v45.85,83.39 IC4A.11 47.99,87.83 J22.10
N$1
  Bottom 0.305: IC4A.1 40.89,73.11 J21.10 39.1,66.76 R21A.1
N$2
  pour Bottom (no thermals): 14.35,19.72 11.68,22.39 arc90 10.82,22.39 9.99,21.56 arc90 9.99,20.7 11.44,19.26 arc45 11.87,19.08 13.47,19.08 arc-45 13.9,18.9 14.6,18.2 arc45 15.03,18.02 16.62,18.02 arc45 17.05,18.2 18.21,19.35 arc90 18.21,20.22 17.39,21.03 arc90 16.53,21.03 15.21,19.72 arc-90
  pour Bottom (no thermals): 11.68,22.39 9.99,20.7 9.45,21.24 arc45 8.75,21.53 6.1,21.53 arc-90 5.47,22.17 arc-90 6.1,22.8 10.85,22.8 arc-45 11.56,22.51
N$3
  Bottom 0.305: J21.1 40.89,87.83 IC4A.10
N$4
  Bottom 0.305: IC4A.6 37.77,80.8 J21.5
N$5
  Bottom 0.305: IC4A.16 51.12,80.14 J22.5
N$14
  Bottom 0.305: C19A.1 R7A.1 J15.4 76.13,56.78 arc-90 75.13,57.78 IC1.7
N$17
  Bottom 0.305: IC5.4 7.7,62.13 J17.1 R8B.2
N$18
  Bottom 0.305: IC5.6 13.72,64.49 J17.3
N$19  (1 unrouted)
  Bottom 0.305: IC2.5 63.37,22.26 arc-45 63.19,22.69 63.19,24.38 arc-45 63.37,24.81 63.84,25.29 arc45 64.01,25.72 J8.3 61.76,30.31
N$20  (1 unrouted)
  Bottom 0.305: IC2.4 62.76,22.15 arc-45 62.59,22.58 62.59,25.64 arc45 62.41,26.07 J8.4 59.96,28.52
N$21  (1 unrouted)
  Bottom 0.305: IC2.3 62.19,22.02 arc-45 62.01,22.45 62.01,22.62 arc45 61.84,23.05 J8.5 58.17,26.72
N$22
  Bottom 0.305: R6B.1 J17.2 9.3,64.49 IC5.5
N$23  (2 unrouted)
  Bottom 0.305: 44.31,71.06 arc-90 44.31,70.6 arc90 44.31,70.14 arc90 44.77,70.14 45.06,70.43 arc-90 45.52,70.43 arc-90 45.52,69.97 45.41,69.85 arc90 45.41,69.39 arc90 45.87,69.39 46.15,69.68 arc-90 46.61,69.68 arc-90 46.61,69.22 arc90 46.61,68.76 46.98,68.39 | 46.98,68.39 | 58.17,28.42 58.17,36.48 47.68,46.97 47.68,55.88 52.06,60.26 52.06,66.5 53.76,68.2 53.76,69.88 J22.2 49.3,74.34 49.3,78.19 IC4A.19
N$24  (1 unrouted)
  Bottom 0.305: 47.75,70.74 arc90 47.29,70.74 47.21,70.66 arc-90 46.75,70.66 arc-90 46.75,71.12 46.83,71.2 arc90 46.83,71.66 | IC4A.15 51.12,80.8 J22.6 53.76,80.04 53.76,71.28 54.58,70.46 54.58,67.62 52.88,65.92 52.88,59.68 48.5,55.3 48.5,47.55 59.96,36.08 R2A.1
N$25
  Bottom 0.305: IC4A.12 49.3,82.75 49.3,86.6 J22.9 53.76,87.66 53.76,81.44 54.58,80.62 54.58,71.86 55.4,71.04 55.4,67.04 53.7,65.34 53.7,59.1 49.32,54.72 49.32,48.13 61.76,35.69 R3A.1
N$26
  Top 0.305: J6.6 77.69,14.38 arc-45 77.98,13.68 77.98,12.53 arc45 78.28,11.82 80.52,9.58 arc-90 80.52,9.12 80.34,8.94 arc90 80.34,8.48 arc90 80.8,8.48 81.97,9.65 arc-90 82.43,9.65 arc-90 82.43,9.19 81.26,8.02 arc90 81.26,7.56 81.56,7.26 arc-45 81.65,7.03 J4.4
  Bottom 0.305: IC2.26 72.54,17.33 arc45 72.97,17.15 74.11,17.15 arc-90 74.39,16.88 74.39,16.43 arc180 74.94,16.43 74.94,16.82 arc-45 75.12,17.25 75.4,17.53 arc-180 75.79,17.14 75.55,16.91 arc90 75.55,16.52 J6.6
N$27  (1 unrouted)
  Bottom 0.305: 29.93,28.52 J12.5 26.26,24.85 arc-45 25.83,24.67 25.65,24.67 arc45 25.22,24.49 IC3.3
N$28  (1 unrouted)
  Bottom 0.305: 31.72,26.72 J12.4 29.28,24.28 arc-45 28.85,24.1 25.79,24.1 arc45 25.36,23.92 IC3.4
N$29  (1 unrouted)
  Bottom 0.305: 33.52,24.93 J12.3 28.92,22.67 arc-45 28.49,22.85 28.02,23.32 arc45 27.59,23.5 25.89,23.5 arc45 25.46,23.32 IC3.5
N$30  (1 unrouted)
  Bottom 0.305: 9.02,41.65 arc-90 8.56,41.65 8.08,42.12 arc90 7.62,42.12 7.59,42.09 arc90 7.59,41.63 arc-90 7.59,41.17 arc-90 7.13,41.17 arc90 6.67,41.17 | IC4A.9 39.59,82.75 39.59,86.6 J21.2 35.12,87.66 35.12,78.9 34.3,78.08 34.3,71.86 33.48,71.04 33.48,67.04 35.99,64.54 35.99,62.21 38.11,60.09 38.11,57.38 40.57,54.92 40.57,39.16 R1B.1
N$31  (1 unrouted)
  Bottom 0.305: 3.7,46.37 arc90 4.03,46.7 arc90 3.7,47.02 3.52,47.02 arc-90 3.19,47.34 arc-90 3.52,47.67 3.7,47.67 | 3.52,45.72 arc-90 3.19,46.05 arc-90 3.52,46.37 3.7,46.37 | 3.7,46.37 | 3.52,45.72 | 3.84,45.4 arc90 3.52,45.72 | 3.7,47.67 arc90 4.03,47.99 arc90 3.7,48.32 3.52,48.32 arc-90 3.19,48.65 | 3.7,47.67 | 3.19,48.65 | 3.19,48.65 arc-90 3.52,48.97 arc90 3.84,49.3 | IC4A.5 37.77,80.14 J21.6 35.12,77.5 35.12,71.28 34.3,70.46 34.3,67.62 36.81,65.12 36.81,62.79 38.93,60.67 38.93,57.96 41.39,55.5 41.39,36.39 R2B.1
N$32  (1 unrouted)
  Bottom 0.305: 7.11,43.45 arc-90 7.43,43.77 7.57,43.77 arc90 7.9,44.1 | 7.43,48.97 arc90 7.11,48.65 arc90 7.43,48.32 7.57,48.32 arc-90 7.9,48 arc-90 7.57,47.67 7.39,47.67 arc90 7.06,47.35 arc90 7.39,47.02 7.57,47.02 arc-90 7.9,46.7 | 7.9,44.1 | 7.9,44.1 arc90 7.57,44.42 7.39,44.42 arc-90 7.06,44.75 arc-90 7.39,45.07 7.57,45.07 arc90 7.9,45.4 arc90 7.57,45.72 7.39,45.72 arc-90 7.06,46.05 arc-90 7.39,46.37 7.57,46.37 arc90 7.9,46.7 | 7.9,46.7 | 7.43,48.97 | 7.76,49.3 arc-90 7.43,48.97 | IC4A.2 39.59,78.19 39.59,74.34 J21.9 35.12,69.88 35.12,68.2 37.63,65.7 37.63,63.37 39.75,61.25 39.75,58.54 42.21,56.08 42.21,33.62 R3B.1
N$34
  Bottom 0.305: IC6.4 70.73,83.7 arc-90 71.73,84.7 J18.1 R8D.2
N$35  (1 unrouted)
  Bottom 0.305: 14.64,28.52 J11.4 16.95,26.32 arc-45 17.66,26.61 19.01,26.61 arc-45 19.72,26.32 20.09,25.95 arc-90 20.09,24.89 19.95,24.75 arc90 19.95,23.89 IC3.46
N$36
  Bottom 0.305: IC7.5 31.88,51.6 arc-45 32.59,51.31 J19.2 R6F.1
N$37  (2 unrouted)
  Bottom 0.305: 62.4,20.39 arc45 61.97,20.57 57.39,20.57 arc-45 56.96,20.75 J8.7 54.58,23.13 56.14,24.7 LDO7.5 | IC2.1 62.4,20.39 | 62.4,20.39
N$38
  Bottom 0.305: IC6.6 72.68,78.68 arc45 73.39,78.97 J18.3
N$40
  Bottom 0.305: IC6.5 72.68,83.1 arc-45 73.39,82.81 J18.2 R6D.1
N$41
  Bottom 0.305: IC1.6 77.08,58.38 arc45 77.79,58.67 J15.3
N$42
  Bottom 0.305: IC6.7 70.73,78.08 arc90 71.73,77.08 J18.4 R7D.1 C19D.1
N$43
  Bottom 0.305: R8F.2 J19.1 30.93,53.2 arc90 29.93,52.2 IC7.4
N$46
  Bottom 0.305: IC7.7 29.93,46.58 arc90 30.93,45.58 J19.4 R7F.1 C19F.1
N$47
  Bottom 0.305: IC8.4 22.83,82.85 arc-90 23.83,83.85 J20.1 R8E.2
N$51
  Bottom 0.305: IC8.6 24.78,77.83 arc45 25.49,78.12 J20.3
N$52
  Bottom 0.305: R6E.1 J20.2 25.49,81.96 arc45 24.78,82.25 IC8.5
N$53
  Bottom 0.305: C19E.1 R7E.1 J20.4 23.83,76.23 arc-90 22.83,77.23 IC8.7
N$66  (2 unrouted)
  Bottom 0.305: 26.32,32.09 28.11,30.3 28.18,30.37 | 26.32,32.09 26.3,32.07 J12.7 23.95,29.73 arc45 23.77,29.3 23.77,24.71 arc-45 23.6,24.28 IC3.1 | LDO8.5 26.32,32.09
N$69
  pour Bottom (no thermals): 75.78,20.76 76.33,20.76 arc45 76.76,20.94 78.21,22.39 arc-90 79.07,22.39 79.9,21.56 arc-90 79.9,20.7 78.79,19.59 arc-45 78.36,19.41 75.31,19.41 arc-45 74.88,19.59 73.65,20.83 arc90 72.78,20.83 71.98,20.02 arc-180 71.73,20.27 72.73,21.27 arc-45 73.16,21.44 74.59,21.44 arc-45 75.02,21.27 75.35,20.94 arc45
  pour Bottom (no thermals): 81.56,21.53 83.78,21.53 arc90 84.42,22.17 arc90 83.78,22.8 79.21,22.8 arc45 78.21,22.39 79.9,20.7 80.14,20.94 arc-45
N$79
  Top 0.305: J10.1 3.25,12.62 arc45 3.16,12.39 J13.1
  Bottom 0.305: IC3.36 17.18,17.87 arc-90 16.32,17.87 arc45 15.96,18.02 15.03,18.02 arc-45 14.6,18.2 13.9,18.9 arc45 13.47,19.08 J10.1
N$80
  Top 0.305: J9.1 19.26,3.48 arc-45 18.55,3.19 arc90 18.23,2.87 18.23,1.62 arc-90 17.9,1.3 arc-90 17.58,1.62 17.58,6.81 arc90 17.25,7.14 arc90 16.93,6.81 16.93,3.52 arc-90 16.6,3.19 J13.6
  Bottom 0.305: IC3.25 21.07,13.98 arc90 21.07,13.12 arc-45 21.22,12.76 21.22,11.83 arc45 21.4,11.4 22.1,10.69 arc-45 22.28,10.26 J9.1
N$81
  Bottom 0.305: IC3.10 27.02,21.34 arc-90 27.88,21.34 31.76,17.46 arc45 32.19,17.28 J9.7
N$82
  Top 0.305: J6.1 70.63,3.48 arc45 71.34,3.19 arc-90 71.66,2.87 71.66,1.62 arc90 71.99,1.3 arc90 72.31,1.62 72.31,6.81 arc-90 72.64,7.14 arc-90 72.96,6.81 72.96,3.52 arc90 73.29,3.19 J4.1
  Bottom 0.305: IC2.36 68.82,13.98 arc-90 68.82,13.12 arc45 68.67,12.76 68.67,11.83 arc-45 68.49,11.4 67.78,10.69 arc45 67.61,10.26 J6.1
N$83
  Top 0.305: J6.3 | J6.3 72.78,10.1 arc-45 73.49,9.8 75.77,7.53 arc-90 75.77,7.07 75.46,6.77 arc90 75.46,6.31 arc90 75.92,6.31 76.85,7.24 arc-90 77.31,7.24 arc-90 77.31,6.78 76.38,5.85 arc90 76.38,5.39 arc90 76.84,5.39 77.91,6.46 arc-90 78.37,6.46 arc-90 78.37,6 78.06,5.69 77.57,5.19 arc90 77.57,4.73 J4.3
  Bottom 0.305: IC2.35 69.36,14.15 arc-45 69.53,13.72 69.53,12.57 arc90 69.81,12.29 70.26,12.29 arc-180 70.26,11.74 69.87,11.74 arc45 69.44,11.57 69.15,11.28 arc180 69.54,10.89 69.78,11.13 arc-90 70.17,11.13 J6.3
N$87
  Top 0.305: J10.3 12.2,14.38 arc45 11.91,13.68 11.91,12.53 arc-45 11.61,11.82 9.37,9.58 arc90 9.37,9.12 9.55,8.94 arc-90 9.55,8.48 arc-90 9.09,8.48 7.92,9.65 arc90 7.46,9.65 arc90 7.46,9.19 8.63,8.02 arc-90 8.63,7.56 8.33,7.26 arc45 8.24,7.03 J13.3
  Bottom 0.305: IC3.35 17.35,17.33 arc-45 16.92,17.15 15.78,17.15 arc90 15.5,16.88 15.5,16.43 arc-180 14.95,16.43 14.95,16.82 arc45 14.77,17.25 14.49,17.53 arc180 14.1,17.14 14.33,16.91 arc-90 14.33,16.52 J10.3
N$88
  Top 0.305: J10.6 17.1,10.1 arc45 16.4,9.8 14.12,7.53 arc90 14.12,7.07 14.43,6.77 arc-90 14.43,6.31 arc-90 13.97,6.31 13.03,7.24 arc90 12.57,7.24 arc90 12.57,6.78 13.51,5.85 arc-90 13.51,5.39 arc-90 13.05,5.39 11.98,6.46 arc90 11.52,6.46 arc90 11.52,6 11.82,5.69 12.32,5.19 arc-90 12.32,4.73 J13.4
  Bottom 0.305: IC3.26 20.53,14.15 arc45 20.36,13.72 20.36,12.57 arc-90 20.08,12.29 19.63,12.29 arc180 19.63,11.74 20.02,11.74 arc-45 20.45,11.57 20.74,11.28 arc-180 20.35,10.89 20.11,11.13 arc90 19.72,11.13 J10.6
N$90
  Top 0.305: J5.1 86.64,12.62 arc-45 86.73,12.39 J4.6
  Bottom 0.305: IC2.25 72.7,17.87 arc90 73.57,17.87 arc-45 73.93,18.02 74.86,18.02 arc45 75.29,18.2 75.99,18.9 arc-45 76.42,19.08 J5.1
N$96  (1 unrouted)
  Bottom 0.305: 58.17,11.43 J7.4 60.37,13.74 arc-45 60.08,14.45 60.08,15.81 arc-45 60.37,16.51 60.74,16.88 arc-90 61.8,16.88 61.94,16.75 arc90 62.8,16.75 IC2.46
N$101
  pour Bottom (no thermals): 23.96,10.9 23.96,10.36 arc45 24.14,9.92 25.59,8.48 arc-90 25.59,7.61 24.77,6.79 arc-90 23.9,6.79 22.8,7.9 arc-45 22.62,8.33 22.62,11.37 arc-45 22.8,11.8 24.03,13.04 arc90 24.03,13.9 23.22,14.71 arc-180 23.47,14.95 24.47,13.95 arc-45 24.65,13.52 24.65,12.09 arc-45 24.47,11.66 24.14,11.34 arc45
  pour Top (no thermals): 26.41,3.45 26.41,7.66 24.97,9.1 arc90 23.28,9.1 arc90 23.28,7.41 25.13,5.56 25.13,3.45 arc90 25.77,2.81 arc90
N$102
  pour Bottom (no thermals): 66.97,11.15 64.3,8.48 arc90 64.3,7.61 65.12,6.79 arc90 65.98,6.79 67.43,8.23 arc45 67.61,8.66 67.61,10.26 arc-45 67.78,10.69 68.49,11.4 arc45 68.67,11.83 68.67,13.41 arc45 68.49,13.85 67.33,15 arc90 66.47,15 65.65,14.19 arc90 65.65,13.33 66.97,12.01 arc-90
  pour Top (no thermals): 64.64,4.62 64.64,3.83 arc-90 64,3.19 arc-90 63.36,3.83 63.36,6.72 arc-45 63.95,8.13 64.91,9.09 arc-90 66.6,9.09 arc-90 66.6,7.4 65.23,6.03 arc45
N$103
  Bottom 0.305: C19B.1 R7B.1 J17.4 15.32,62.13 IC5.7
N$104
  Bottom 0.305: R8A.2 J15.1 76.13,64.4 arc90 75.13,63.4 IC1.4
N$105  (via drill 0.3)
  other vias: 67.61,24.67
  pour Bottom (no thermals): 69.26,25.08 67.68,23.51 arc-90 66.82,23.51 65.85,24.47 67.4,26.02 arc-45 67.84,26.2 68.74,26.2 arc-45 69.18,26.02 69.26,25.94 arc-90
N$106  (via drill 0.3)
  Bottom 0.305: IC2.7 64.42,22.61 arc45 63.99,22.79 SMUTE1.1
  other vias: 63.89,22.79
N$107  (via drill 0.3)
  other vias: 27.88,19.08
  pour Bottom (no thermals): 28.28,17.43 26.71,19 arc-90 26.71,19.86 27.68,20.83 29.23,19.28 arc-45 29.41,18.85 29.41,17.94 arc-45 29.23,17.51 29.15,17.43 arc-90
N$108
  Bottom 0.305: IC4.7 79.83,37.58 arc90 80.83,36.58 J16.4 R7C.1 C19C.1
N$109
  Bottom 0.305: IC4.6 81.78,38.18 arc45 82.49,38.47 J16.3
N$110
  Bottom 0.305: IC4.5 81.78,42.6 arc-45 82.49,42.31 J16.2 R6C.1
N$111
  Bottom 0.305: IC1.5 77.08,62.8 arc-45 77.79,62.51 J15.2 R6A.1
N$112
  Bottom 0.305: IC7.6 31.88,47.18 arc45 32.59,47.47 J19.3
N$113
  Bottom 0.305: IC4.4 79.83,43.2 arc-90 80.83,44.2 J16.1 R8C.2
N$114  (via drill 0.3)
  Bottom 0.305: IC3.7 25.82,22.26 arc45 26,22.69 SMUTE2.1
  other vias: 26,22.79
N$116
  Bottom 0.305: IC3.11 27.19,20.81 arc-90 27.7,20.81 29.18,19.33 arc-45 29.36,18.9 29.36,17.64 arc45 29.54,17.21 J9.6
PDN  (via drill 0.35)  (2 unrouted)
  Top 0.305: v14.59,90.73 arc45 14.11,90.93 8.49,90.93 arc-90 6.49,92.93 J3.1 | v63.8,30.7 59.21,26.11 arc45 58.63,24.7 J8.6
  Bottom 0.305: IC2.2 61.84,21.66 arc45 61.41,21.84 59.71,21.84 arc-45 59.27,22.02 J8.6 | IC3.2 24.87,24.85 arc45 25.05,25.28 25.05,26.98 arc-45 25.23,27.41 J12.6 27.44,28.06 arc45 28.15,28.35 39.75,39.95 39.75,54.34 37.29,56.8 37.29,59.51 35.17,61.63 35.17,63.96 32.66,66.46 32.66,71.62 33.48,72.44 33.48,78.66 34.3,79.48 34.3,88.24 35.12,89.06 35.12,91.28 34.36,92.04 | v14.59,90.73 arc45 15.07,90.53 32.85,90.53 34.36,92.04 | 6.49,93.02 J3.1 3.19,96.31 | 34.36,92.04 35.92,93.6 37.72,93.6 41.08,90.24 47.8,90.24 51.16,93.6 52.96,93.6 53.76,92.8 53.76,89.06 54.58,88.24 54.58,82.02 55.4,81.2 55.4,72.44 56.22,71.62 56.22,66.46 54.52,64.76 54.52,58.52 50.14,54.14 50.14,48.71 63.8,35.04 v63.8,30.7
SCL0  (via drill 0.35)  (1 unrouted)
  Top 0.305: v16.72,91.55 arc45 16.24,91.75 11.03,91.75 arc-90 9.03,93.75 J3.2 | J8.2 65.81,30.93 arc45 65.44,31.82 arc90 62.92,31.82 55.9,24.8 v44,24.8
  Bottom 0.305: IC2.8 63.93,23.81 arc-90 63.93,24.67 65.63,26.37 arc45 65.81,26.8 J8.2 65.81,34.3 65.81,34.43 50.96,49.29 50.96,53.56 55.34,57.95 55.34,64.18 57.04,65.88 57.04,72.2 56.22,73.02 56.22,81.78 55.4,82.6 55.4,88.82 54.58,89.64 54.58,93.38 53.54,94.42 50.58,94.42 47.22,91.06 41.66,91.06 38.3,94.42 35.34,94.42 32.27,91.35 17.21,91.35 arc-45 v16.72,91.55 | IC3.8 27.02,22.75 arc-90 27.88,22.75 29.58,21.05 arc45 30.01,20.87 J12.2 36.98,24.8 v44,24.8 | 9.03,93.02 J3.2
SDA0  (via drill 0.35)  (1 unrouted)
  Top 0.305: J8.1 65.83,33.43 arc90 61.69,33.43 54.96,26.7 44,26.7 v41.17,23.87 | v18.86,92.37 arc45 18.37,92.57 13.57,92.57 arc-90 11.57,94.57 J3.3
  Bottom 0.305: IC2.9 64.64,23.81 arc-90 64.64,24.67 67.43,27.46 arc45 67.61,27.89 J8.1 67.61,34.04 51.78,49.87 51.78,52.98 56.16,57.37 56.16,63.6 57.86,65.3 57.86,72.78 57.04,73.6 57.04,82.36 56.22,83.18 56.22,89.4 55.4,90.22 55.4,93.96 54.12,95.24 50.01,95.24 46.65,91.88 42.24,91.88 38.88,95.24 34.77,95.24 31.69,92.17 19.34,92.17 arc-45 v18.86,92.37 | IC3.9 27.02,22.05 arc-90 27.88,22.05 30.67,19.26 arc45 31.1,19.08 J12.1 39.64,23.87 v41.17,23.87 | 11.57,93.02 J3.3
VCC/1
  Bottom 0.305: IC5.3 6.68,61.63 R8B.1 | IC7.3 29.43,53.8 arc-45 29.72,54.51 R8F.1
  Bottom 1.272: C25B.1 1.3,78.89 1.3,71.9 | 1.3,71.9 1.3,57.82 C20B.1 J17.8 C21B.1 | 1.3,71.9 20.8,71.9 25.62,67.08 C21F.1 J19.8 C20F.1
  pour Bottom (rank 2, no thermals): 4.7,78.02 4.7,85.47 arc90 4.38,85.79 0.33,85.79 arc90 0,85.47 0,78.02 arc90 0.33,77.69 4.38,77.69 arc90
  pour Bottom (no thermals): 10.01,61.8 7.18,61.8 arc90 6.18,60.8 6.18,57.3 arc90 7.18,56.3 10.44,56.3 arc90 11.44,57.3 11.44,59.24 arc90 10.72,59.96 arc-90 10.01,60.67
  pour Bottom (no thermals): 29.6,50.89 29.6,54.72 25.1,54.72 arc90 24.1,53.72 24.1,50.46 arc90 25.1,49.46 27.04,49.46 arc90 27.76,50.18 arc-90 28.47,50.89
VCC/2
  Top 1.272: J20.8 18.52,89.72 25.1,96.3 38.3,96.3 42.3,92.3 47.9,92.3 52.4,96.8 60.74,96.8 C25C.1
  Bottom 0.305: IC6.3 70.23,85.31 arc-45 70.52,86.01 R8D.1 | IC8.3 22.33,84.45 arc-45 22.62,85.16 R8E.1
  Bottom 1.272: J2.1 66.42,95.79 C21D.1 J18.8 C20D.1 | C21E.1 J20.8 C20E.1
  pour Bottom (no thermals): 67.13,97.81 62.31,97.81 arc90 61.31,96.81 61.31,94.29 arc90 62.31,93.29 67.13,93.29 arc90 68.13,94.29 68.13,96.81 arc90
  pour Bottom (no thermals): 70.4,82.39 70.4,85.22 arc90 69.4,86.22 65.9,86.22 arc90 64.9,85.22 64.9,81.96 arc90 65.9,80.96 67.84,80.96 arc90 68.56,81.68 arc-90 69.27,82.39
  pour Bottom (no thermals): 22.5,81.54 22.5,84.37 arc90 21.5,85.37 18,85.37 arc90 17,84.37 17,81.11 arc90 18,80.11 19.94,80.11 arc90 20.66,80.83 arc-90 21.37,81.54
VCC/3
  Bottom 0.305: IC4.3 79.33,44.8 arc-45 79.62,45.51 R8C.1 | IC1.3 74.63,65 arc-45 74.92,65.71 R8A.1
  Bottom 1.272: J14.1 82.5,80.16 82.5,70.7 | 82.5,70.7 70.82,70.7 C20A.1 J15.8 C21A.1 | 82.5,70.7 85.3,67.9 85.3,50.5 75.52,50.5 C21C.1 J16.8 C20C.1
  pour Bottom (no thermals): 88.2,79.97 88.2,85.95 arc90 87.2,86.95 86.2,86.95 arc90 85.2,85.95 85.2,79.97 arc90 86.2,78.97 87.2,78.97 arc90
  pour Bottom (no thermals): 74.8,62.09 74.8,64.92 arc90 73.8,65.92 70.3,65.92 arc90 69.3,64.92 69.3,61.66 arc90 70.3,60.66 72.24,60.66 arc90 72.96,61.38 arc-90 73.67,62.09
  pour Bottom (no thermals): 79.5,41.89 79.5,44.72 arc90 78.5,45.72 75,45.72 arc90 74,44.72 74,41.46 arc90 75,40.46 76.94,40.46 arc90 77.66,41.18 arc-90 78.37,41.89

## Text on the board
tNames: SLOW | VCML VREFHL AVDD MCLK DGND +3.3V | SD LRCK DATA BICK PDN DVDD | SD LRCK DATA BICK PDN DVDD | VCMR DGND VREFHR +3.3V DIF1 DIF0 | AOLP | SLOW | AORP | DGND AORN VDDR VDDL AOLN DGND | VCMR DGND VREFHR +3.3V DIF1 DIF0 | VCML VREFHL AVDD MCLK DGND +3.3V | DGND AORN VDDR VDDL AOLN DGND | AORP | AOLP
tDocu: RIGHT | LEFT | AOLP DGND AOLN AORN DGND AORP | AOLP DGND AOLN AORN DGND AORP